# Altium schematic sheet Headstage.SchDoc: Headstage
size A3; DrawnBy: Bruno Almeida; DocumentNumber: 1; SheetNumber: 1; SheetTotal: 1
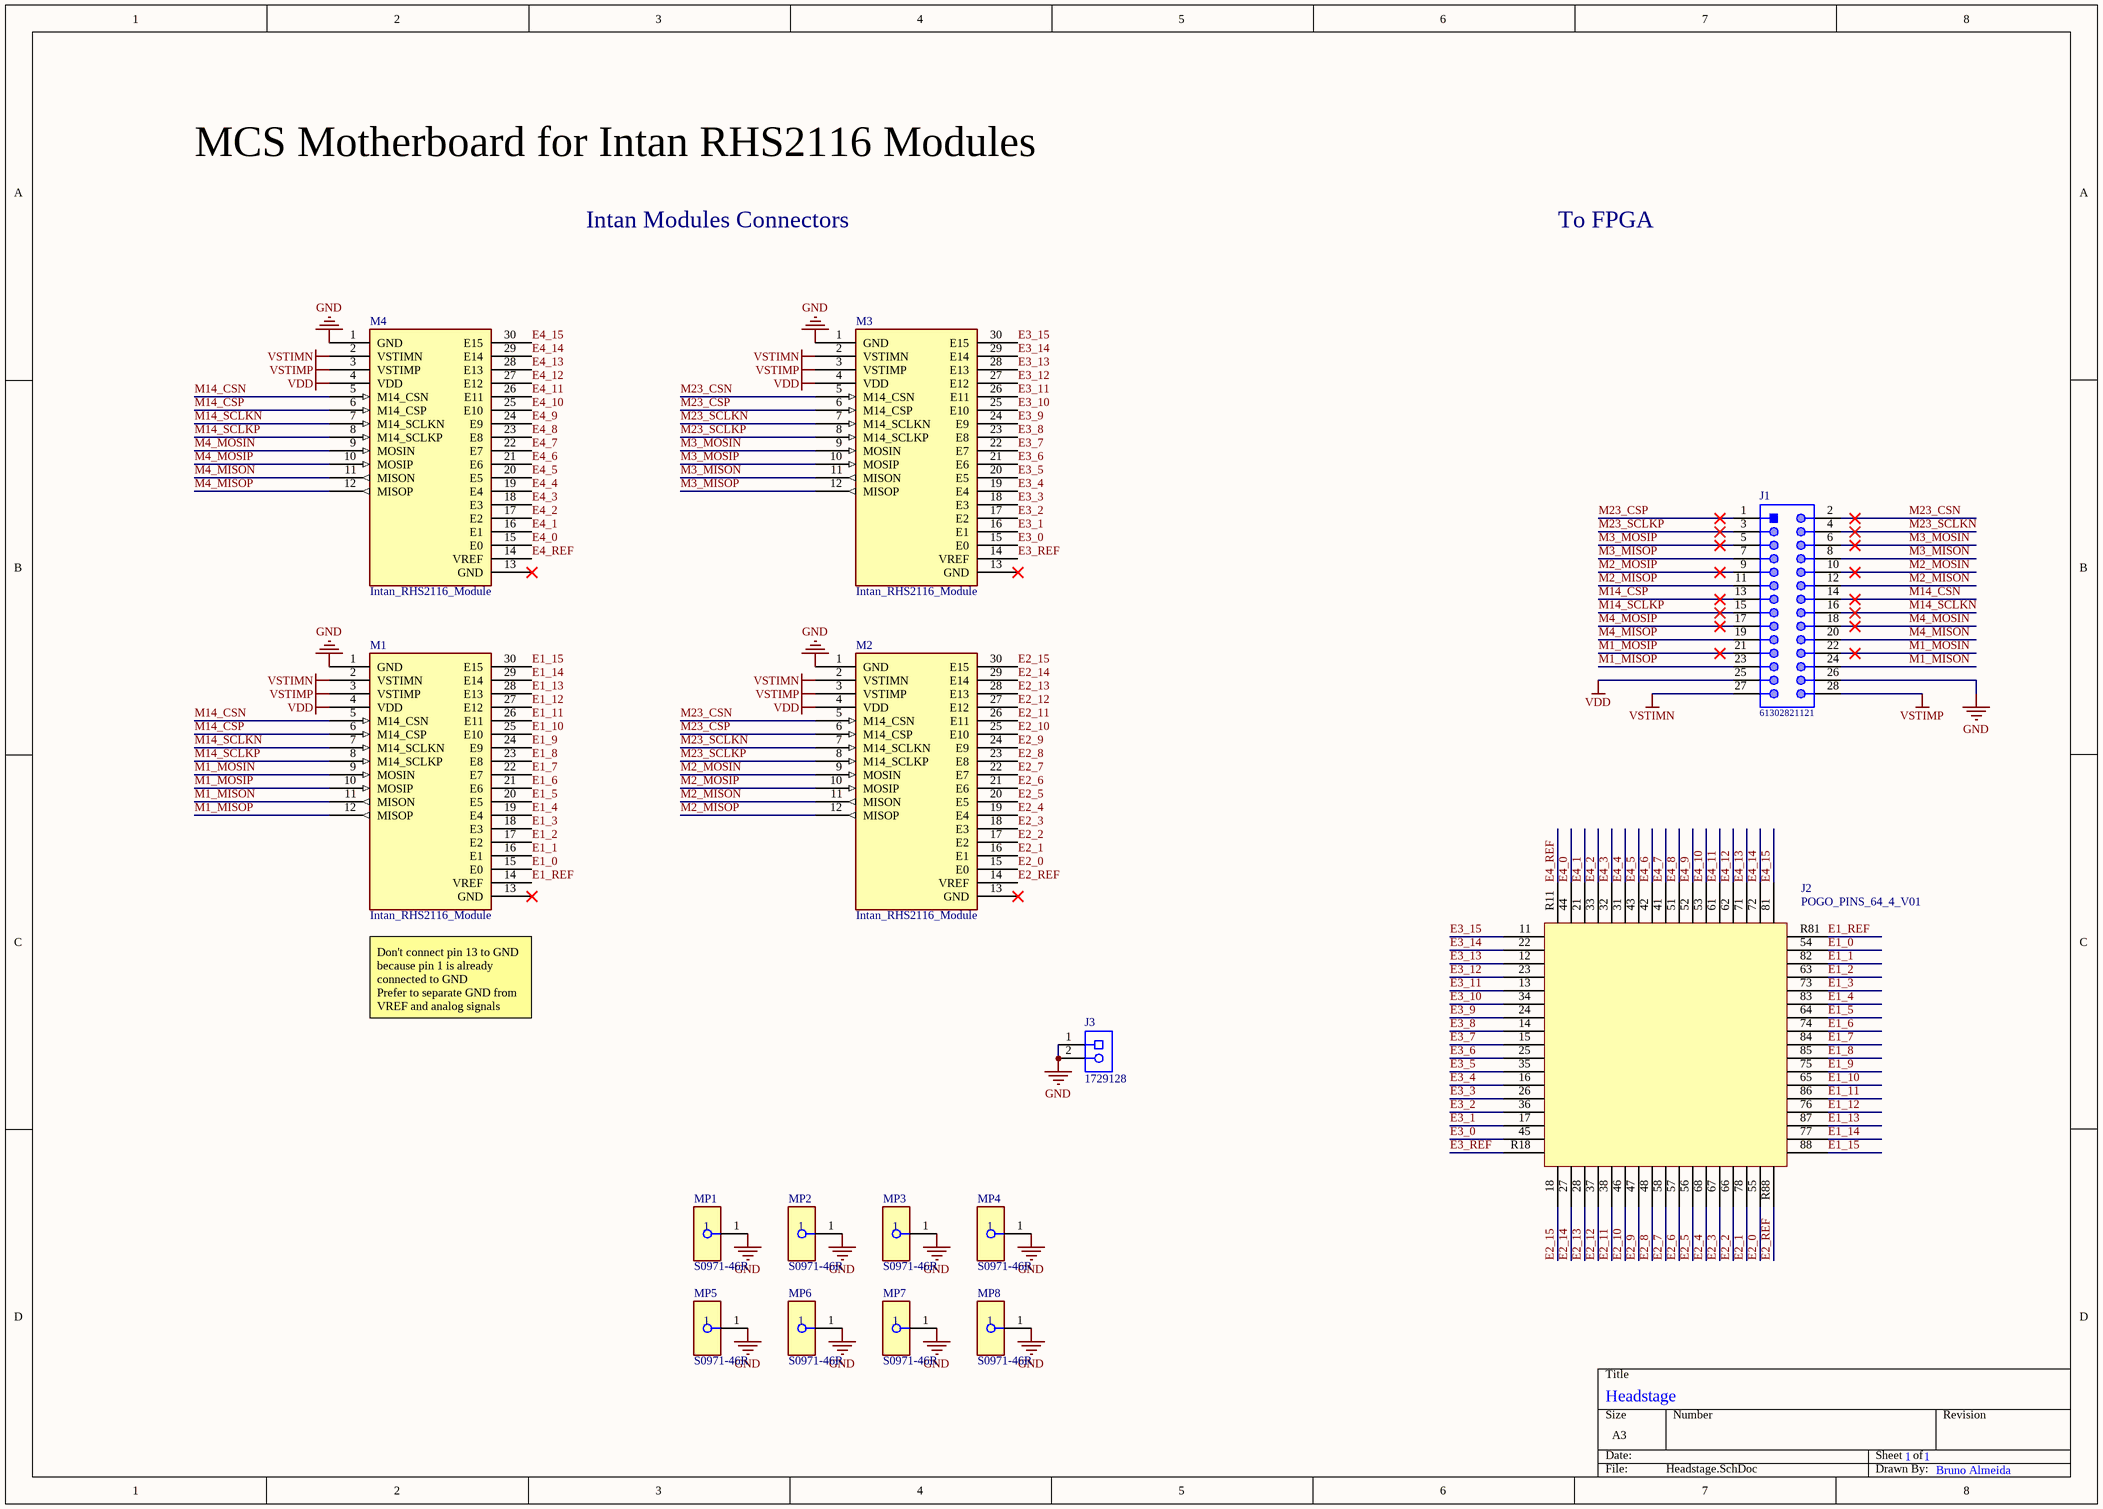
[diagram p0: Headstage.SchDoc]

## Parts
J1  61302821121  [61302821121]
J2  POGO_PINS_64_4_V01  [POGO_PINS_64_4_V01]
J3  1729128  [PHOE-1729128-2_V]
M1  Intan_RHS2116_Module  [Intan_RHS2116_Module]  (no BOM)
M2  Intan_RHS2116_Module  [Intan_RHS2116_Module]  (no BOM)
M3  Intan_RHS2116_Module  [Intan_RHS2116_Module]  (no BOM)
M4  Intan_RHS2116_Module  [Intan_RHS2116_Module]  (no BOM)
MP1  S0971-46R  [FP-S0971-46R-MFG]
MP2  S0971-46R  [FP-S0971-46R-MFG]
MP3  S0971-46R  [FP-S0971-46R-MFG]
MP4  S0971-46R  [FP-S0971-46R-MFG]
MP5  S0971-46R  [FP-S0971-46R-MFG]
MP6  S0971-46R  [FP-S0971-46R-MFG]
MP7  S0971-46R  [FP-S0971-46R-MFG]
MP8  S0971-46R  [FP-S0971-46R-MFG]

## Nets
GND: J1.26 J3.1 J3.2 M1.1(GND) M2.1(GND) M3.1(GND) M4.1(GND) MP1.1 MP2.1 MP3.1 MP4.1 MP5.1 MP6.1 MP7.1 MP8.1
VDD: J1.25 M1.4(VDD) M2.4(VDD) M3.4(VDD) M4.4(VDD)
VSTIMN: J1.27 M1.2(VSTIMN) M2.2(VSTIMN) M3.2(VSTIMN) M4.2(VSTIMN)
VSTIMP: J1.28 M1.3(VSTIMP) M2.3(VSTIMP) M3.3(VSTIMP) M4.3(VSTIMP)
E1_0: J2.54 M1.15(E0)
E1_1: J2.82 M1.16(E1)
E1_2: J2.63 M1.17(E2)
E1_3: J2.73 M1.18(E3)
E1_4: J2.83 M1.19(E4)
E1_5: J2.64 M1.20(E5)
E1_6: J2.74 M1.21(E6)
E1_7: J2.84 M1.22(E7)
E1_8: J2.85 M1.23(E8)
E1_9: J2.75 M1.24(E9)
E1_10: J2.65 M1.25(E10)
E1_11: J2.86 M1.26(E11)
E1_12: J2.76 M1.27(E12)
E1_13: J2.87 M1.28(E13)
E1_14: J2.77 M1.29(E14)
E1_15: J2.88 M1.30(E15)
E1_REF: J2.R81 M1.14(VREF)
E2_0: J2.55 M2.15(E0)
E2_1: J2.78 M2.16(E1)
E2_2: J2.66 M2.17(E2)
E2_3: J2.67 M2.18(E3)
E2_4: J2.68 M2.19(E4)
E2_5: J2.56 M2.20(E5)
E2_6: J2.57 M2.21(E6)
E2_7: J2.58 M2.22(E7)
E2_8: J2.48 M2.23(E8)
E2_9: J2.47 M2.24(E9)
E2_10: J2.46 M2.25(E10)
E2_11: J2.38 M2.26(E11)
E2_12: J2.37 M2.27(E12)
E2_13: J2.28 M2.28(E13)
E2_14: J2.27 M2.29(E14)
E2_15: J2.18 M2.30(E15)
E2_REF: J2.R88 M2.14(VREF)
E3_0: J2.45 M3.15(E0)
E3_1: J2.17 M3.16(E1)
E3_2: J2.36 M3.17(E2)
E3_3: J2.26 M3.18(E3)
E3_4: J2.16 M3.19(E4)
E3_5: J2.35 M3.20(E5)
E3_6: J2.25 M3.21(E6)
E3_7: J2.15 M3.22(E7)
E3_8: J2.14 M3.23(E8)
E3_9: J2.24 M3.24(E9)
E3_10: J2.34 M3.25(E10)
E3_11: J2.13 M3.26(E11)
E3_12: J2.23 M3.27(E12)
E3_13: J2.12 M3.28(E13)
E3_14: J2.22 M3.29(E14)
E3_15: J2.11 M3.30(E15)
E3_REF: J2.R18 M3.14(VREF)
E4_0: J2.44 M4.15(E0)
E4_1: J2.21 M4.16(E1)
E4_2: J2.33 M4.17(E2)
E4_3: J2.32 M4.18(E3)
E4_4: J2.31 M4.19(E4)
E4_5: J2.43 M4.20(E5)
E4_6: J2.42 M4.21(E6)
E4_7: J2.41 M4.22(E7)
E4_8: J2.51 M4.23(E8)
E4_9: J2.52 M4.24(E9)
E4_10: J2.53 M4.25(E10)
E4_11: J2.61 M4.26(E11)
E4_12: J2.62 M4.27(E12)
E4_13: J2.71 M4.28(E13)
E4_14: J2.72 M4.29(E14)
E4_15: J2.81 M4.30(E15)
E4_REF: J2.R11 M4.14(VREF)
M1_MISON: J1.24 M1.11(MISON)
M1_MISOP: J1.23 M1.12(MISOP)
M1_MOSIN: J1.22 M1.9(MOSIN)
M1_MOSIP: J1.21 M1.10(MOSIP)
M2_MISON: J1.12 M2.11(MISON)
M2_MISOP: J1.11 M2.12(MISOP)
M2_MOSIN: J1.10 M2.9(MOSIN)
M2_MOSIP: J1.9 M2.10(MOSIP)
M3_MISON: J1.8 M3.11(MISON)
M3_MISOP: J1.7 M3.12(MISOP)
M3_MOSIN: J1.6 M3.9(MOSIN)
M3_MOSIP: J1.5 M3.10(MOSIP)
M4_MISON: J1.20 M4.11(MISON)
M4_MISOP: J1.19 M4.12(MISOP)
M4_MOSIN: J1.18 M4.9(MOSIN)
M4_MOSIP: J1.17 M4.10(MOSIP)
M14_CSN: J1.14 M1.5(M14_CSN) M4.5(M14_CSN)
M14_CSP: J1.13 M1.6(M14_CSP) M4.6(M14_CSP)
M14_SCLKN: J1.16 M1.7(M14_SCLKN) M4.7(M14_SCLKN)
M14_SCLKP: J1.15 M1.8(M14_SCLKP) M4.8(M14_SCLKP)
M23_CSN: J1.2 M2.5(M14_CSN) M3.5(M14_CSN)
M23_CSP: J1.1 M2.6(M14_CSP) M3.6(M14_CSP)
M23_SCLKN: J1.4 M2.7(M14_SCLKN) M3.7(M14_SCLKN)
M23_SCLKP: J1.3 M2.8(M14_SCLKP) M3.8(M14_SCLKP)

Not connected (* = marked no-connect by the designer): M1 13(GND)*; M2 13(GND)*; M3 13(GND)*; M4 13(GND)*

## Notes on the sheet
- MCS Motherboard for Intan RHS2116 Modules
- Intan Modules Connectors
- To FPGA
- (near M1) Don't connect pin 13 to GND because pin 1 is already connected to GND
  Prefer to separate GND from VREF and analog signals

## Library data of the parts
J1 = CMP-1502-01115-1: THT Vertical Pin Header WR-PHD, Pitch 2.54 mm, Dual Row, 28 pins; Manufacturer: Wurth Elektronik; Pin Number: 28; Contact Resistance: 20mOhm; Withstanding Voltage: 500VAC; Pitch: 2.54mm; Gender: Male; Working Voltage: 250VAC; Rated Current: 3A; Package Reference: 61302821121; Part Number: 61302821121; Mounting Technology: THT; Packaging: Bag; Manufacturer URL: http://www.we-online.de; Row Number: Dual; Orientation: Vertical; Operating Temperature: -40to105degC; Datasheet URL: https://katalog.we-online.de/em/datasheet/6130xx21121.pdf; Publisher: WurthElektronik
J2 = POGO_PINS_64_4_V01: Pogo pins, 64 recording, 4 reference, v01
J3 = CMP-2000-05815-1: PCB Terminal Block, 13.5 A, 400 V, 2-Pin THD, RoHS, Bulk; Manufacturer: Phoenix Contact; Package Version: 03/2015; No. of Rows: 1; Pitch: 5.08mm; No. of Positions: 2; Voltage Rating: 400V; Current Rating: 13500mA; Manufacturer URL: http://www.phoenixcontact.com/; Datasheet URL: https://datasheet.ciiva.com/16046/1729128-16046181.pdf; RoHS: TRUE; Package URL: https://www.phoenixcontact.com/online/portal/pi/pxc/product_detail_page/!ut/p/b1/3VdJjqNKFDxLH8AFycySyWY2ozFsEPOMMQaDOX1XedGL_1Vdm5YXJleknhSKeBkvI6EA8ncAo3AYoDhBQGco6KN7VURTdemj9us_IEKEZo_YHiPAEWEFmDGOHMORkqKYCORBZxgL7ZoaZYcbFFUZ3fqxSY6GOuxydWUuHqz1ynmMFygu583Bob0Ewr6Sd_l-5m-kAueHiB0jpRwZwe58wwtkpxtMYd_LmGcDRU02dRNEyWt6Y2ti5pSyJ_reIkzIulrqApdnbT11V5jnCKbYNCvhEM1MCpPByat_X379-iThf08CI5GfOPqfBeS3BRoBOdD55AKVv0iLwCMq-2BrzXWSGRH7pUGD9uwXQjiph3xL0DKQwdGa0JImiIOmBNOestqgwTHSSs2oOep-78apyXQBvNi8ZLaFjvjWvcaUEBu0MC6Wbe-d6mB0FAebo2lUWinqYaZs5DAYzV0RP9yitUjnGJ0iI9xhZkT42OCQNUJJhkgWINNQLP2JFP6OpMg3JCVg70jqHT0lvKOnhHf0lPuOnnLf0VPuWx6_dxwUIvwk5WMkT0kLL1mh61l2yZVSzG3pYV_bqo-mj6uMKwKwdnnW8Jh5RTOJzMOA5c-eJDaZQw4mTMPH02PvS_ZAqNVjVTo2WyYLkwH_KU1mmmG5kjRhDqPXLwwVHvVOjCM60-fpXvTDfMGW1PVFVS1r4e4yVDk4ZdNbkUHvqPqQSeian4UD39fNKmachqdJ1NJbyk8rXT9mXTvPk3oE5meulKGgiruPJek-4I9hTT6G8ZLOyRSm2RRVbThERQad5OS28hdt4YW4vG0stgYYzsWsK4_7y6DZMjJSCqri1kyiZR5vD7pwIrNR7QwPHTcLTI5qT7eRlpHrdGiupYlqQDJ7zy_CND8fWWBoLRXxk1RVcXiBQwbTD4Xi7KL-FuO94t9xaqweXzH; PartNumber: 1729128; Package Description: 2-Pin Through Hole Device, Body 8.1 x 10.16 mm, Pitch 5.08 mm; Datasheet Version: 12/2013; Mounting Technology: ThroughHole; Orientation: Horizontal; Package Reference: 1729128-2; Packing: Bulk
MP1-MP8 = CMP-15817-000004-1: RFI SHIELD CLIP MINI TIN SMD; Manufacturer: Harwin; Is Female: yes; Number Of Contacts: 1; Conn Orientation: Vertical; ComponentLink2URL: https://cdn.harwin.com/pdfs/S0971-46R.pdf; Digikey Description: RFI SHIELD CLIP MINI TIN SMD; ComponentLink2Description: Datasheet; Height: 2.1mm; Mouser Description: EZ-Shield Clip, SMT, Mini, Stainless Steel, tin, Tape & Reeled; Contact Material: Tin,Nickel; RoHS: TRUE; Device Class L1: Connectors; Lead Free: Yes; Package: S0971-46R; Manufacturer Part Number: S0971-46R; Temperature Range High: +150°C; Device Class L2: unset; Category: UNK; Octopart: https://octopart.com/s0971-46r-harwin-30988305; Temperature Range Low: -25°C; Device Class L3: unset; Automotive: No; Temperature: -25°C to +150°C